# Altium project RGBlinker.PrjPcb
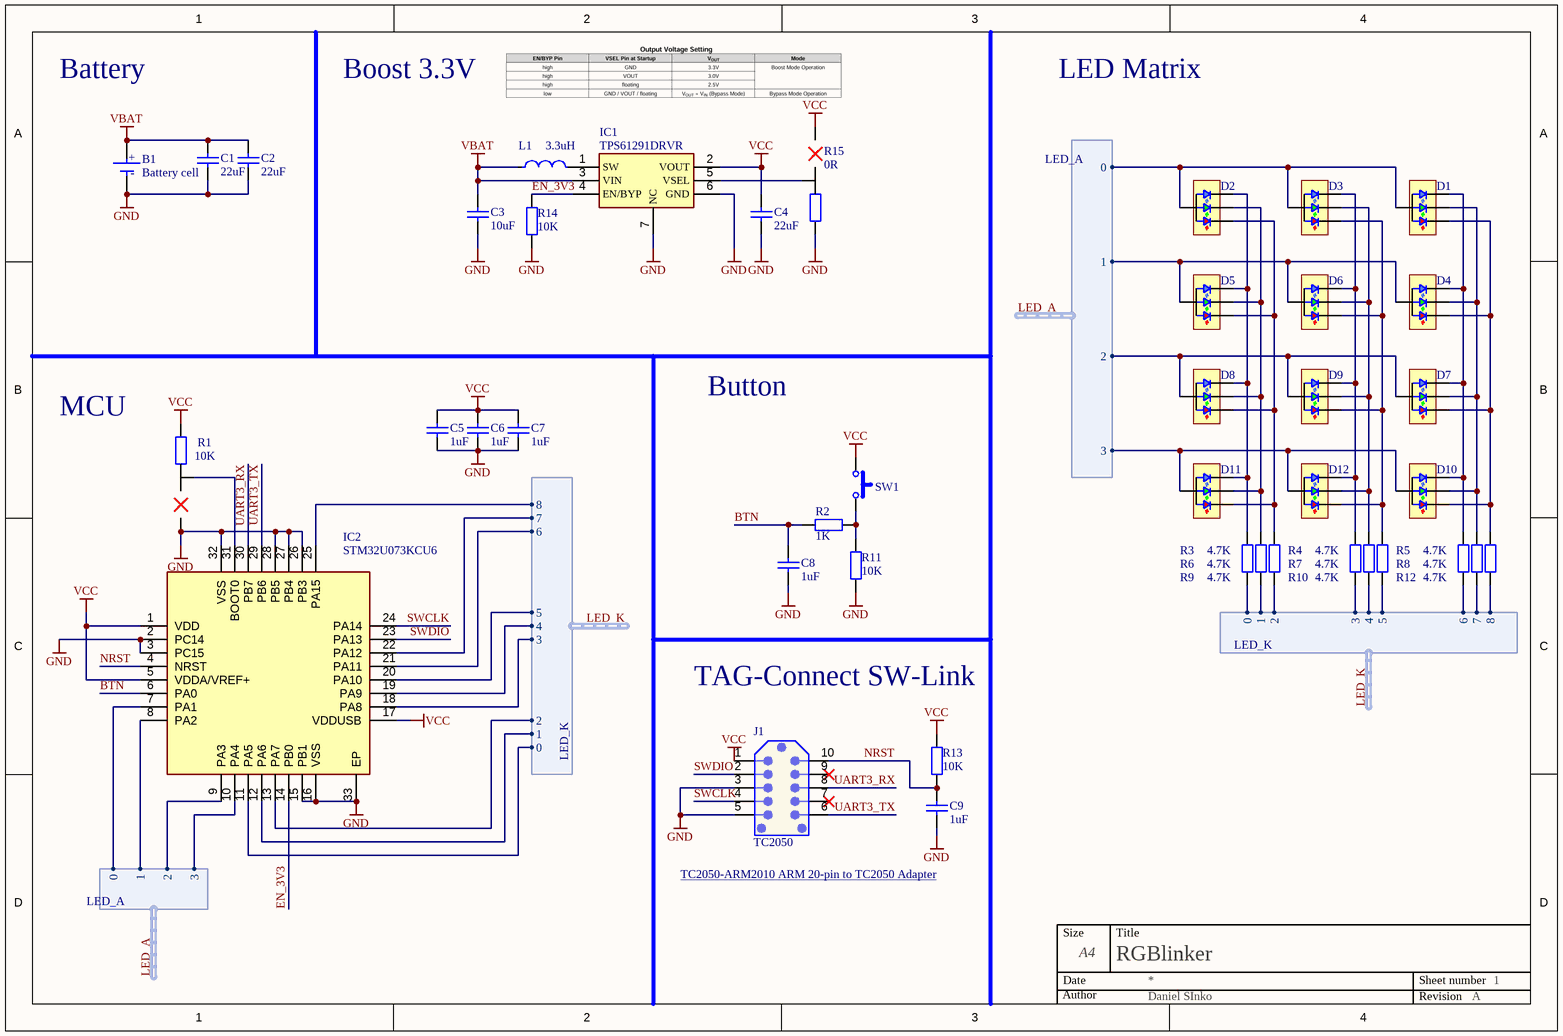
[diagram p0: Main.SchDoc]
1 sheet, 42 parts. Net scope: global (net labels, ports and power ports of the same name join across sheets).
Board file: RGBlink.PcbDoc

## Sheet Main.SchDoc: RGBlinker
size A4; Author: Daniel SInko; Revision: A; SheetNumber: 1; SheetTotal: 1

### Parts
B1  Battery cell  [BAT_CR2032_SMALL]
C1  22uF  [CAP0603]
C2  22uF  [CAP0603]
C3  10uF  [CAP0603]
C4  22uF  [CAP0603]
C5  1uF  [CAP0603]
C6  1uF  [CAP0603]
C7  1uF  [CAP0603]
C8  1uF  [CAP0603]
C9  1uF  [CAP0603]
D1  UHD111A-FKA-C3K23E1L3VG5ZB3Z3  [UHD111A-FKA-C3K23E1L3VG5ZB3Z3]  (value not drawn)
D2  UHD111A-FKA-C3K23E1L3VG5ZB3Z3  [UHD111A-FKA-C3K23E1L3VG5ZB3Z3]  (value not drawn)
D3  UHD111A-FKA-C3K23E1L3VG5ZB3Z3  [UHD111A-FKA-C3K23E1L3VG5ZB3Z3]  (value not drawn)
D4  UHD111A-FKA-C3K23E1L3VG5ZB3Z3  [UHD111A-FKA-C3K23E1L3VG5ZB3Z3]  (value not drawn)
D5  UHD111A-FKA-C3K23E1L3VG5ZB3Z3  [UHD111A-FKA-C3K23E1L3VG5ZB3Z3]  (value not drawn)
D6  UHD111A-FKA-C3K23E1L3VG5ZB3Z3  [UHD111A-FKA-C3K23E1L3VG5ZB3Z3]  (value not drawn)
D7  UHD111A-FKA-C3K23E1L3VG5ZB3Z3  [UHD111A-FKA-C3K23E1L3VG5ZB3Z3]  (value not drawn)
D8  UHD111A-FKA-C3K23E1L3VG5ZB3Z3  [UHD111A-FKA-C3K23E1L3VG5ZB3Z3]  (value not drawn)
D9  UHD111A-FKA-C3K23E1L3VG5ZB3Z3  [UHD111A-FKA-C3K23E1L3VG5ZB3Z3]  (value not drawn)
D10  UHD111A-FKA-C3K23E1L3VG5ZB3Z3  [UHD111A-FKA-C3K23E1L3VG5ZB3Z3]  (value not drawn)
D11  UHD111A-FKA-C3K23E1L3VG5ZB3Z3  [UHD111A-FKA-C3K23E1L3VG5ZB3Z3]  (value not drawn)
D12  UHD111A-FKA-C3K23E1L3VG5ZB3Z3  [UHD111A-FKA-C3K23E1L3VG5ZB3Z3]  (value not drawn)
IC1  TPS61291DRVR  [WSON-6]
IC2  STM32U073KCU6  [UFQFPN32-5x5]
J1  TC2050  [TC2050-NL]
L1  value 3.3uH  [IND1008]  (hidden comment: Inductor)
R1  10K  [RES0603_SELECTION]
R2  1K  [RES0603]
R3  4.7K  [RES0603]
R4  4.7K  [RES0603]
R5  4.7K  [RES0603]
R6  4.7K  [RES0603]
R7  4.7K  [RES0603]
R8  4.7K  [RES0603]
R9  4.7K  [RES0603]
R10  4.7K  [RES0603]
R11  10K  [RES0603]
R12  4.7K  [RES0603]
R13  10K  [RES0603]
R14  10K  [RES0603]
R15  0R  [RES0603_SELECTION]
SW1  TS18-5-25-SL-260-SMT-TR  [BUTTON_LP_5x5]  (value not drawn)

### Harnesses
LED_K: 6, 7, 8, 0, 1, 2, 3, 4, 5
LED_A: 0, 1, 2, 3

### Nets
GND: B1.- C1.1 C2.1 C3.1 C4.1 C5.1 C6.1 C7.1 C8.1 C9.1 IC1.6(GND) IC1.7(NC) IC2.2(PC14) IC2.3(PC15) IC2.15(PB1) IC2.16(VSS) IC2.26(PB3) IC2.27(PB4) IC2.28(PB5) IC2.32(VSS) IC2.33(EP) J1.3 J1.5 R1.3 R11.1 R14.1 R15.1
VBAT: B1.+ C1.2 C2.2 C3.2 IC1.3(VIN) L1.1
VCC: C4.2 C5.2 C6.2 C7.2 IC1.2(VOUT) IC2.1(VDD) IC2.5(VDDA/VREF+) IC2.17(VDDUSB) J1.1 R1.1 R13.2 R15.3 SW1.1
BTN: C8.2 IC2.6(PA0) R2.1
EN_3V3: IC1.4(EN/BYP) IC2.14(PB0) R14.2
LED_A.0: D1.4 D2.4 D3.4 IC2.7(PA1) ; harness LED_A.0
LED_A.1: D4.4 D5.4 D6.4 IC2.8(PA2) ; harness LED_A.1
LED_A.2: D7.4 D8.4 D9.4 IC2.9(PA3) ; harness LED_A.2
LED_A.3: D10.4 D11.4 D12.4 IC2.10(PA4) ; harness LED_A.3
LED_K.0: IC2.11(PA5) R3.1 ; harness LED_K.0
LED_K.1: IC2.12(PA6) R6.1 ; harness LED_K.1
LED_K.2: IC2.13(PA7) R9.1 ; harness LED_K.2
LED_K.3: IC2.18(PA8) R4.1 ; harness LED_K.3
LED_K.4: IC2.19(PA9) R7.1 ; harness LED_K.4
LED_K.5: IC2.20(PA10) R10.1 ; harness LED_K.5
LED_K.6: IC2.21(PA11) R5.1 ; harness LED_K.6
LED_K.7: IC2.22(PA12) R8.1 ; harness LED_K.7
LED_K.8: IC2.25(PA15) R12.1 ; harness LED_K.8
NRST: C9.2 IC2.4(NRST) J1.10 R13.1
SWCLK: IC2.24(PA14) J1.4
SWDIO: IC2.23(PA13) J1.2
UART3_RX: IC2.30(PB7) J1.8
UART3_TX: IC2.29(PB6) J1.6
NetD1_1: D1.1 D4.1 D7.1 D10.1 R5.2
NetD1_2: D1.2 D4.2 D7.2 D10.2 R8.2
NetD1_3: D1.3 D4.3 D7.3 D10.3 R12.2
NetD2_1: D2.1 D5.1 D8.1 D11.1 R3.2
NetD2_2: D2.2 D5.2 D8.2 D11.2 R6.2
NetD2_3: D2.3 D5.3 D8.3 D11.3 R9.2
NetD3_1: D3.1 D6.1 D9.1 D12.1 R4.2
NetD3_2: D3.2 D6.2 D9.2 D12.2 R7.2
NetD3_3: D3.3 D6.3 D9.3 D12.3 R10.2
NetIC1_1: IC1.1(SW) L1.2
NetIC1_5: IC1.5(VSEL) R15.2
NetIC2_31: IC2.31(BOOT0) R1.2
NetR2_2: R2.2 R11.2 SW1.2

Not connected (* = marked no-connect by the designer): J1 7* 9*

### Notes on the sheet
- Battery
- Boost 3.3V
- LED Matrix
- MCU
- Button
- TAG-Connect SW-Link
- TC2050-ARM2010 ARM 20-pin to TC2050 Adapter <https://www.tag-connect.com/wp-content/uploads/bsk-pdf-manager/2021/02/TC2050-ARM2010-2021.pdf>
- Size
- Date
- A4
- Title
- Sheet number
- Author
- Revision

### Library data of the parts
C1 C2 C4 = 22uF: Capacitor; Voltage: *; Value: 22uF
C3 = 10uF: Capacitor; Voltage: *; Value: 10uF
C5-C9 = 1uF: Capacitor; Voltage: *; Value: 1uF
IC1 = TPS61291DRVR: Integrated Circuit; Manufacturer_Name: Texas Instruments; Datasheet Link: http://www.ti.com/lit/ds/symlink/tps61291.pdf; Height: 0.8mm; Manufacturer_Part_Number: TPS61291DRVR; Mouser Part Number: 595-TPS61291DRVR; Mouser Price/Stock: https://www.mouser.co.uk/ProductDetail/Texas-Instruments/TPS61291DRVR?qs=6E8igxPflKdi99VfHtbMIA%3D%3D; Arrow Part Number: TPS61291DRVR; Arrow Price/Stock: https://www.arrow.com/en/products/tps61291drvr/texas-instruments?utm_currency=USD&region=nac; LCSC Part Number: C464809
IC2 = STM32U073KCU6: Integrated Circuit; Manufacturer_Name: STMicroelectronics; Datasheet Link: https://www.st.com/resource/en/datasheet/stm32u073c8.pdf; Height: 0.6mm; Manufacturer_Part_Number: STM32U073KCU6; Mouser Part Number: 511-STM32U073KCU6; Mouser Price/Stock: https://www.mouser.co.uk/ProductDetail/STMicroelectronics/STM32U073KCU6?qs=dbcCsuKDzFVf3x6MF6CcAQ%3D%3D
J1 = TC2050: TC2050 JTAG CONNECTOR DNP
L1 = 3.3uH: General Purpose Inductor, 4.7uH, 20%, 1 Element, Ferrite-Core, SMD, 1608M; Manufacturer: TDK; Manufacturer Part Number: MLZ1608E4R7MT; Manufacturer Series: MLZ; Case/Size Code: 1608-M; DC Resistance (DCR): 500mR; Inductor Application: POWER INDUCTOR; Channels: 1; Max Current Rating: 350mA; Self Resonant Frequency: 80MHz; Shape/Size Description: RECTANGULAR PACKAGE; Shielding: Shielded; Test Frequency: 2MHz; Package Height: 0.8mm; Package Length: 1.6mm; Supplier: Mouser; Supplier Part Number: 810-MLZ1608E4R7MT; RoHS: Yes; Category: Fixed Inductors; Stock: 10382; Pricing: 1=0.1, 10=0.063, 50=0.063, 100=0.053, 1000=0.047, 10000=0.038 (USD); Pins: 2; Terminal Finish: Tin; Core Material: Ferrite; Min Operating Temperature: -55°C; Max Operating Temperature: 125°C; Tolerance: 20%; JESD-609 Code: e3; Inductance-Nom (L): 4.7uH; Inductor Type: GENERAL PURPOSE INDUCTOR; Surface Mount: Yes; Terminal Placement: Dual Ended; Termination: Wraparound; Construction: Magnetic Shielded; Package Style: SMTMeter; Packaging: Tape and Reel; Series: MLZ1608; Package Width: 0.8mm; Reach SVHC Compliant: Yes; RoHS Compliant: Yes; ComponentLink1URL: https://datasheet.ciiva.com:443/pdfs/VipMasterIC/IC/TDKC/TDKCS08829/TDKCS08829-1.pdf?src-supplier=IHS+Markit; ComponentLink1Description: https://datasheet.ciiva.com:443/pdfs/VipMasterIC/IC/TDKC/TDKCS08829/TDKCS08829-1.pdf?src-supplier=IHS+Markit; ComponentLink2URL: https://datasheet.ciiva.com/11802/0900766b8082f86f-11802261.pdf?src-supplier=Rs; ComponentLink2Description: https://datasheet.ciiva.com/11802/0900766b8082f86f-11802261.pdf?src-supplier=Rs
R1 R15 = Resistor_Selection: Resistor selection between 2 value.
  R1: Value: 10K; LCSC Part Number: C2906974
  R15: Value: 0R
R2 = 1K: Fixed Resistor, Metal Glaze/thick Film, 0.1W, 1000ohm, 75V, 1% +/-Tol, 100ppm/Cel, Surface Mount, 0603; Manufacturer: Bourns; Manufacturer Part Number: CR0603-FX-1001ELF; Rated Temperature: 70°C; Temperature Coefficient: 100ppm/°C; Working Voltage: 50V; Package Height: 0.45mm; Package Length: 1.6mm; Package Width: 0.8mm; Supplier Part Number: 652-CR0603FX-1001ELF; RoHS: Yes; Category: Chip SMD Resistors; Stock: 320220; Pricing: 1=0.1, 10=0.009, 50=0.009, 100=0.005, 1000=0.004, 10000=0.002 (USD); Mounting Technology: Surface Mount; Pins: 2; Package Shape: Rectangular; Case/Package: 0603; Terminal Finish: Nickel; Min Operating Temperature: -55°C; Max Operating Temperature: 155°C; JESD-609 Code: e3; Termination: Wraparound; Resistor Type: FIXED RESISTOR; Construction: Chip; Packaging: Tape and Reel; Technology: RUTHENIUM OXIDE; Reach SVHC Compliant: Yes; RoHS Compliant: Yes; ComponentLink1URL: https://datasheet.ciiva.com:443/pdfs/VipMasterIC/IC/BOUR/BOUR-S-A0009069624/BOUR-S-A0009069624-1.pdf?src-supplier=IHS+Markit; ComponentLink1Description: https://datasheet.ciiva.com:443/pdfs/VipMasterIC/IC/BOUR/BOUR-S-A0009069624/BOUR-S-A0009069624-1.pdf?src-supplier=IHS+Markit; ComponentLink2URL: https://datasheet.ciiva.com/11808/0900766b80fcdb72-11808035.pdf?src-supplier=Rs; ComponentLink2Description: https://datasheet.ciiva.com/11808/0900766b80fcdb72-11808035.pdf?src-supplier=Rs; ComponentLink3URL: https://datasheet.ciiva.com/19466/774882-19466523.pdf?src-supplier=Jameco; ComponentLink3Description: https://datasheet.ciiva.com/19466/774882-19466523.pdf?src-supplier=Jameco; ComponentLink4URL: https://datasheet.ciiva.com/7001/1902866-7001622.pdf?src-supplier=Newark; ComponentLink4Description: https://datasheet.ciiva.com/7001/1902866-7001622.pdf?src-supplier=Newark; ComponentLink5URL: https://datasheet.ciiva.com/7986/691949-7986156.pdf?src-supplier=Element14; ComponentLink5Description: https://datasheet.ciiva.com/7986/691949-7986156.pdf?src-supplier=Element14; ComponentLink6URL: https://datasheet.ciiva.com/22693/1902866-22693205.pdf?src-supplier=Element14; ComponentLink6Description: https://datasheet.ciiva.com/22693/1902866-22693205.pdf?src-supplier=Element14; ComponentLink7URL: https://datasheet.ciiva.com/5546/chpreztr-5546283.pdf?src-supplier=Mouser; ComponentLink7Description: https://datasheet.ciiva.com/5546/chpreztr-5546283.pdf?src-supplier=Mouser; ComponentLink8URL: https://datasheet.ciiva.com/16757/70154685-16757482.pdf?src-supplier=Allied+Electronics; ComponentLink8Description: https://datasheet.ciiva.com/16757/70154685-16757482.pdf?src-supplier=Allied+Electronics; ComponentLink9URL: https://datasheet.ciiva.com/3255/chpreztr-3255917.pdf?src-supplier=Avnet; ComponentLink9Description: https://datasheet.ciiva.com/3255/chpreztr-3255917.pdf?src-supplier=Avnet; ComponentLink10URL: https://datasheet.ciiva.com/6547/chpreztr-6547350.pdf?src-supplier=Digikey; ComponentLink10Description: https://datasheet.ciiva.com/6547/chpreztr-6547350.pdf?src-supplier=Digikey; ComponentLink11URL: https://datasheet.ciiva.com/6547/chpreztr-6547351.pdf?src-supplier=Digikey; ComponentLink11Description: https://datasheet.ciiva.com/6547/chpreztr-6547351.pdf?src-supplier=Digikey; ComponentLink12URL: https://datasheet.ciiva.com/6547/chpreztr-6547349.pdf?src-supplier=Digikey; ComponentLink12Description: https://datasheet.ciiva.com/6547/chpreztr-6547349.pdf?src-supplier=Digikey; ComponentLink13URL: https://datasheet.ciiva.com/30115/159chpreztr-30115222.pdf?src-supplier=Onlinecomponents.com; ComponentLink13Description: https://datasheet.ciiva.com/30115/159chpreztr-30115222.pdf?src-supplier=Onlinecomponents.com; Value: 1K
R3-R10 R12 = 4.7K: Resistor; Value: 4.7K
R11 R13 R14 = 10K: Fixed Resistor, Metal Glaze/thick Film, 0.1W, 10000ohm, 75V, 1% +/-Tol, 100ppm/Cel, Surface Mount, 0603; Manufacturer: Bourns; Manufacturer Part Number: CR0603-FX-1002ELF; Rated Temperature: 70°C; Temperature Coefficient: 100ppm/°C; Working Voltage: 50V; Package Height: 0.45mm; Package Length: 1.6mm; Package Width: 0.8mm; Supplier Part Number: 652-CR0603FX-1002ELF; RoHS: Yes; Category: Chip SMD Resistors; Stock: 335503; Pricing: 1=0.1, 10=0.009, 50=0.009, 100=0.005, 1000=0.004, 10000=0.002 (USD); Mounting Technology: Surface Mount; Pins: 2; Package Shape: Rectangular; Case/Package: 0603; Terminal Finish: Nickel; Min Operating Temperature: -55°C; Max Operating Temperature: 155°C; Termination: Wraparound; JESD-609 Code: e3; Resistor Type: FIXED RESISTOR; Construction: Chip; Packaging: Tape and Reel; Technology: RUTHENIUM OXIDE; Reach SVHC Compliant: Yes; RoHS Compliant: Yes; ComponentLink1URL: https://datasheet.ciiva.com:443/pdfs/VipMasterIC/IC/BOUR/BOUR-S-A0009069624/BOUR-S-A0009069624-1.pdf?src-supplier=IHS+Markit; ComponentLink1Description: https://datasheet.ciiva.com:443/pdfs/VipMasterIC/IC/BOUR/BOUR-S-A0009069624/BOUR-S-A0009069624-1.pdf?src-supplier=IHS+Markit; ComponentLink2URL: https://datasheet.ciiva.com/11808/0900766b80fcdb72-11808032.pdf?src-supplier=Rs; ComponentLink2Description: https://datasheet.ciiva.com/11808/0900766b80fcdb72-11808032.pdf?src-supplier=Rs; ComponentLink3URL: https://datasheet.ciiva.com/27049/774903-27049975.pdf?src-supplier=Jameco; ComponentLink3Description: https://datasheet.ciiva.com/27049/774903-27049975.pdf?src-supplier=Jameco; ComponentLink4URL: https://datasheet.ciiva.com/22644/1849498-22644171.pdf?src-supplier=Element14; ComponentLink4Description: https://datasheet.ciiva.com/22644/1849498-22644171.pdf?src-supplier=Element14; ComponentLink5URL: https://datasheet.ciiva.com/22693/1902866-22693206.pdf?src-supplier=Element14; ComponentLink5Description: https://datasheet.ciiva.com/22693/1902866-22693206.pdf?src-supplier=Element14; ComponentLink6URL: https://datasheet.ciiva.com/5548/chpreztr-5548911.pdf?src-supplier=Mouser; ComponentLink6Description: https://datasheet.ciiva.com/5548/chpreztr-5548911.pdf?src-supplier=Mouser; ComponentLink7URL: https://datasheet.ciiva.com/16757/70154685-16757483.pdf?src-supplier=Allied+Electronics; ComponentLink7Description: https://datasheet.ciiva.com/16757/70154685-16757483.pdf?src-supplier=Allied+Electronics; ComponentLink8URL: https://datasheet.ciiva.com/3255/chpreztr-3255918.pdf?src-supplier=Avnet; ComponentLink8Description: https://datasheet.ciiva.com/3255/chpreztr-3255918.pdf?src-supplier=Avnet; ComponentLink9URL: https://datasheet.ciiva.com/7001/1902866-7001623.pdf?src-supplier=Newark; ComponentLink9Description: https://datasheet.ciiva.com/7001/1902866-7001623.pdf?src-supplier=Newark; Value: 10K
SW1 = TS18-5-25-SL-260-SMT-TR: Switch; Manufacturer_Name: Same Sky; Datasheet Link: https://www.sameskydevices.com/product/resource/supplyframepdf/ts18.pdf; Height: 2.7mm; Manufacturer_Part_Number: TS18-5-25-SL-260-SMT-TR; Mouser Price/Stock: https://www.mouser.co.uk/ProductDetail/Same-Sky/TS18-5-25-SL-260-SMT-TR?qs=tlsG%2FOw5FFh0yS4gYnfcwg%3D%3D; Supplier Part Number: 179-TS18525SL260SMTT
D1-D12 = UHD111A-FKA-C3K23E1L3VG5ZB3Z3: Supplier Part Number: 941-UHD1AA3K3E3V53Z3
  D10: LCSC Part Number: C5333730